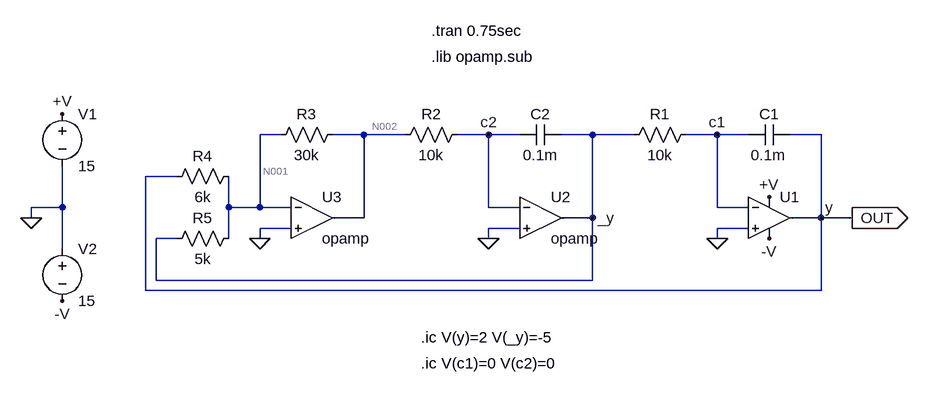
[diagram p0: schematic commnet23_ps1.asc]
commnet23_ps1.asc, the LTspice schematic file:
Version 4
SHEET 1 1404 680
WIRE -240 80 -272 80
WIRE -112 80 -160 80
WIRE -48 80 -112 80
WIRE 80 80 32 80
WIRE 128 80 80 80
WIRE 240 80 192 80
WIRE 304 80 240 80
WIRE 432 80 384 80
WIRE 480 80 432 80
WIRE 592 80 544 80
WIRE -400 144 -448 144
WIRE -576 192 -576 128
WIRE -576 192 -624 192
WIRE -320 192 -320 144
WIRE -272 192 -272 80
WIRE -272 192 -320 192
WIRE -224 192 -272 192
WIRE 80 192 80 80
WIRE 128 192 80 192
WIRE 432 192 432 80
WIRE 480 192 432 192
WIRE -624 208 -624 192
WIRE -112 208 -112 80
WIRE -112 208 -160 208
WIRE 240 208 240 80
WIRE 240 208 192 208
WIRE 592 208 592 80
WIRE 592 208 544 208
WIRE 640 208 592 208
WIRE -224 224 -272 224
WIRE 128 224 80 224
WIRE 480 224 432 224
WIRE -400 240 -432 240
WIRE -320 240 -320 192
WIRE -272 240 -272 224
WIRE 80 240 80 224
WIRE 432 240 432 224
WIRE -576 256 -576 192
WIRE -432 304 -432 240
WIRE 240 304 240 208
WIRE 240 304 -432 304
WIRE -448 320 -448 144
WIRE 592 320 592 208
WIRE 592 320 -448 320
FLAG -576 48 +V
FLAG -576 336 -V
FLAG 512 176 +V
FLAG 512 240 -V
FLAG -272 240 0
FLAG 80 240 0
FLAG 432 240 0
FLAG -624 208 0
FLAG 640 208 OUT
IOPIN 640 208 Out
FLAG 432 80 c1
FLAG 80 80 c2
FLAG 240 208 _y
FLAG 592 208 y
SYMBOL res 400 64 R90
WINDOW 0 0 56 VBottom 2
WINDOW 3 32 56 VTop 2
SYMATTR InstName R1
SYMATTR Value 10k
SYMBOL cap 544 64 R90
WINDOW 0 0 32 VBottom 2
WINDOW 3 32 33 VTop 2
SYMATTR InstName C1
SYMATTR Value 0.1m
SYMBOL res 48 64 R90
WINDOW 0 0 56 VBottom 2
WINDOW 3 32 56 VTop 2
SYMATTR InstName R2
SYMATTR Value 10k
SYMBOL cap 192 64 R90
WINDOW 0 0 32 VBottom 2
WINDOW 3 32 32 VTop 2
SYMATTR InstName C2
SYMATTR Value 0.1m
SYMBOL res -144 64 R90
WINDOW 0 0 56 VBottom 2
WINDOW 3 32 56 VTop 2
SYMATTR InstName R3
SYMATTR Value 30k
SYMBOL res -304 128 R90
WINDOW 0 0 56 VBottom 2
WINDOW 3 32 56 VTop 2
SYMATTR InstName R4
SYMATTR Value 6k
SYMBOL res -304 224 R90
WINDOW 0 0 56 VBottom 2
WINDOW 3 32 56 VTop 2
SYMATTR InstName R5
SYMATTR Value 5k
SYMBOL OpAmps\\UniversalOpAmp2 512 208 R0
SYMATTR InstName U1
SYMBOL OpAmps\\opamp -192 144 R0
SYMATTR InstName U3
SYMBOL OpAmps\\opamp 160 144 R0
SYMATTR InstName U2
SYMBOL voltage -576 32 R0
WINDOW 123 0 0 Left 0
WINDOW 39 0 0 Left 0
SYMATTR InstName V1
SYMATTR Value 15
SYMBOL voltage -576 240 R0
WINDOW 123 0 0 Left 0
WINDOW 39 0 0 Left 0
SYMATTR InstName V2
SYMATTR Value 15
TEXT -8 -80 Left 2 !.tran 0.75sec
TEXT -8 -40 Left 2 !.lib opamp.sub
TEXT -24 392 Left 2 !.ic V(y)=2 V(_y)=-5
TEXT -24 432 Left 2 !.ic V(c1)=0 V(c2)=0

The netlist it stands for:
* commnet23_ps1.asc
R1 c1 _y 10k
C1 y c1 0.1m
R2 c2 N002 10k
C2 _y c2 0.1m
R3 N002 N001 30k
R4 N001 y 6k
R5 N001 _y 5k
XU1 0 c1 +V -V y level2 Avol=1Meg GBW=10Meg Slew=10Meg Ilimit=25m Rail=0 Vos=0 En=0 Enk=0 In=0 Ink=0 Rin=500Meg  ; pins In+ In- V+ V- OUT
XU3 N001 0 N002 opamp Aol=100K GBW=10Meg  ; pins invin noninvin out
XU2 c2 0 _y opamp Aol=100K GBW=10Meg  ; pins invin noninvin out
V1 +V 0 15
V2 0 -V 15
.tran 0.75sec
.lib opamp.sub
.ic V(y)=2 V(_y)=-5
.ic V(c1)=0 V(c2)=0
.lib UniversalOpAmp2.lib
.backanno
.end

* Results of the author's LTspice run, read from the files saved beside the schematic
* Operating Point, zero values left out:
*   V(_y) = -5 V
*   V(y) = 2 V
*   V(n002) = 20 V
*   V(n001) = -200 µV
*   V(+v) = 15 V
*   V(-v) = -15 V
*   I(R5) = 1 mA
*   I(R4) = -333.4 µA
*   I(R3) = 666.6 µA
*   I(R2) = -2 mA
*   I(R1) = 500 µA
*   I(V2) = -25 mA
*   I(V1) = -1.724 µA
*   Ix(u1:3) = 1.724 µA
*   Ix(u1:4) = -25 mA
*   Ix(u1:5) = 25 mA
*   Ix(u3:3) = -2.666 mA
*   Ix(u2:3) = -5 A
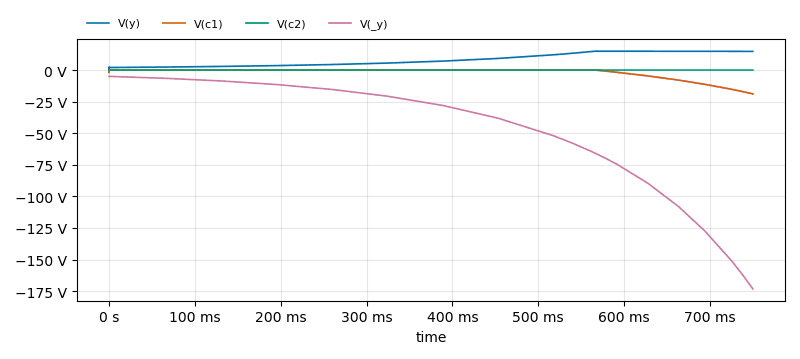
[diagram p1: Transient Analysis of commnet23_ps1.asc, plotted from the saved traces]
* Transient Analysis, 1 run:
*   V(y): min 8.344 mV, max 14.9 V, average 8.123 V, rms 9.507 V, last 14.77 V
*   V(c1): min -18.85 V, max 1.032 mV, average -1.99 V, rms 4.859 V, last -18.85 V
*   V(c2): min 0 V, max 1.749 mV, average 447 µV, rms 624 µV, last 1.749 mV
*   V(_y): min -173.2 V, max -5 V, average -44.31 V, rms 61.83 V, last -173.2 V